# Altium schematic sheet Power Sources and Supply.SchDoc
size Tabloid; DrawnBy: Krutav Shah; SheetNumber: 4; SheetTotal: 6
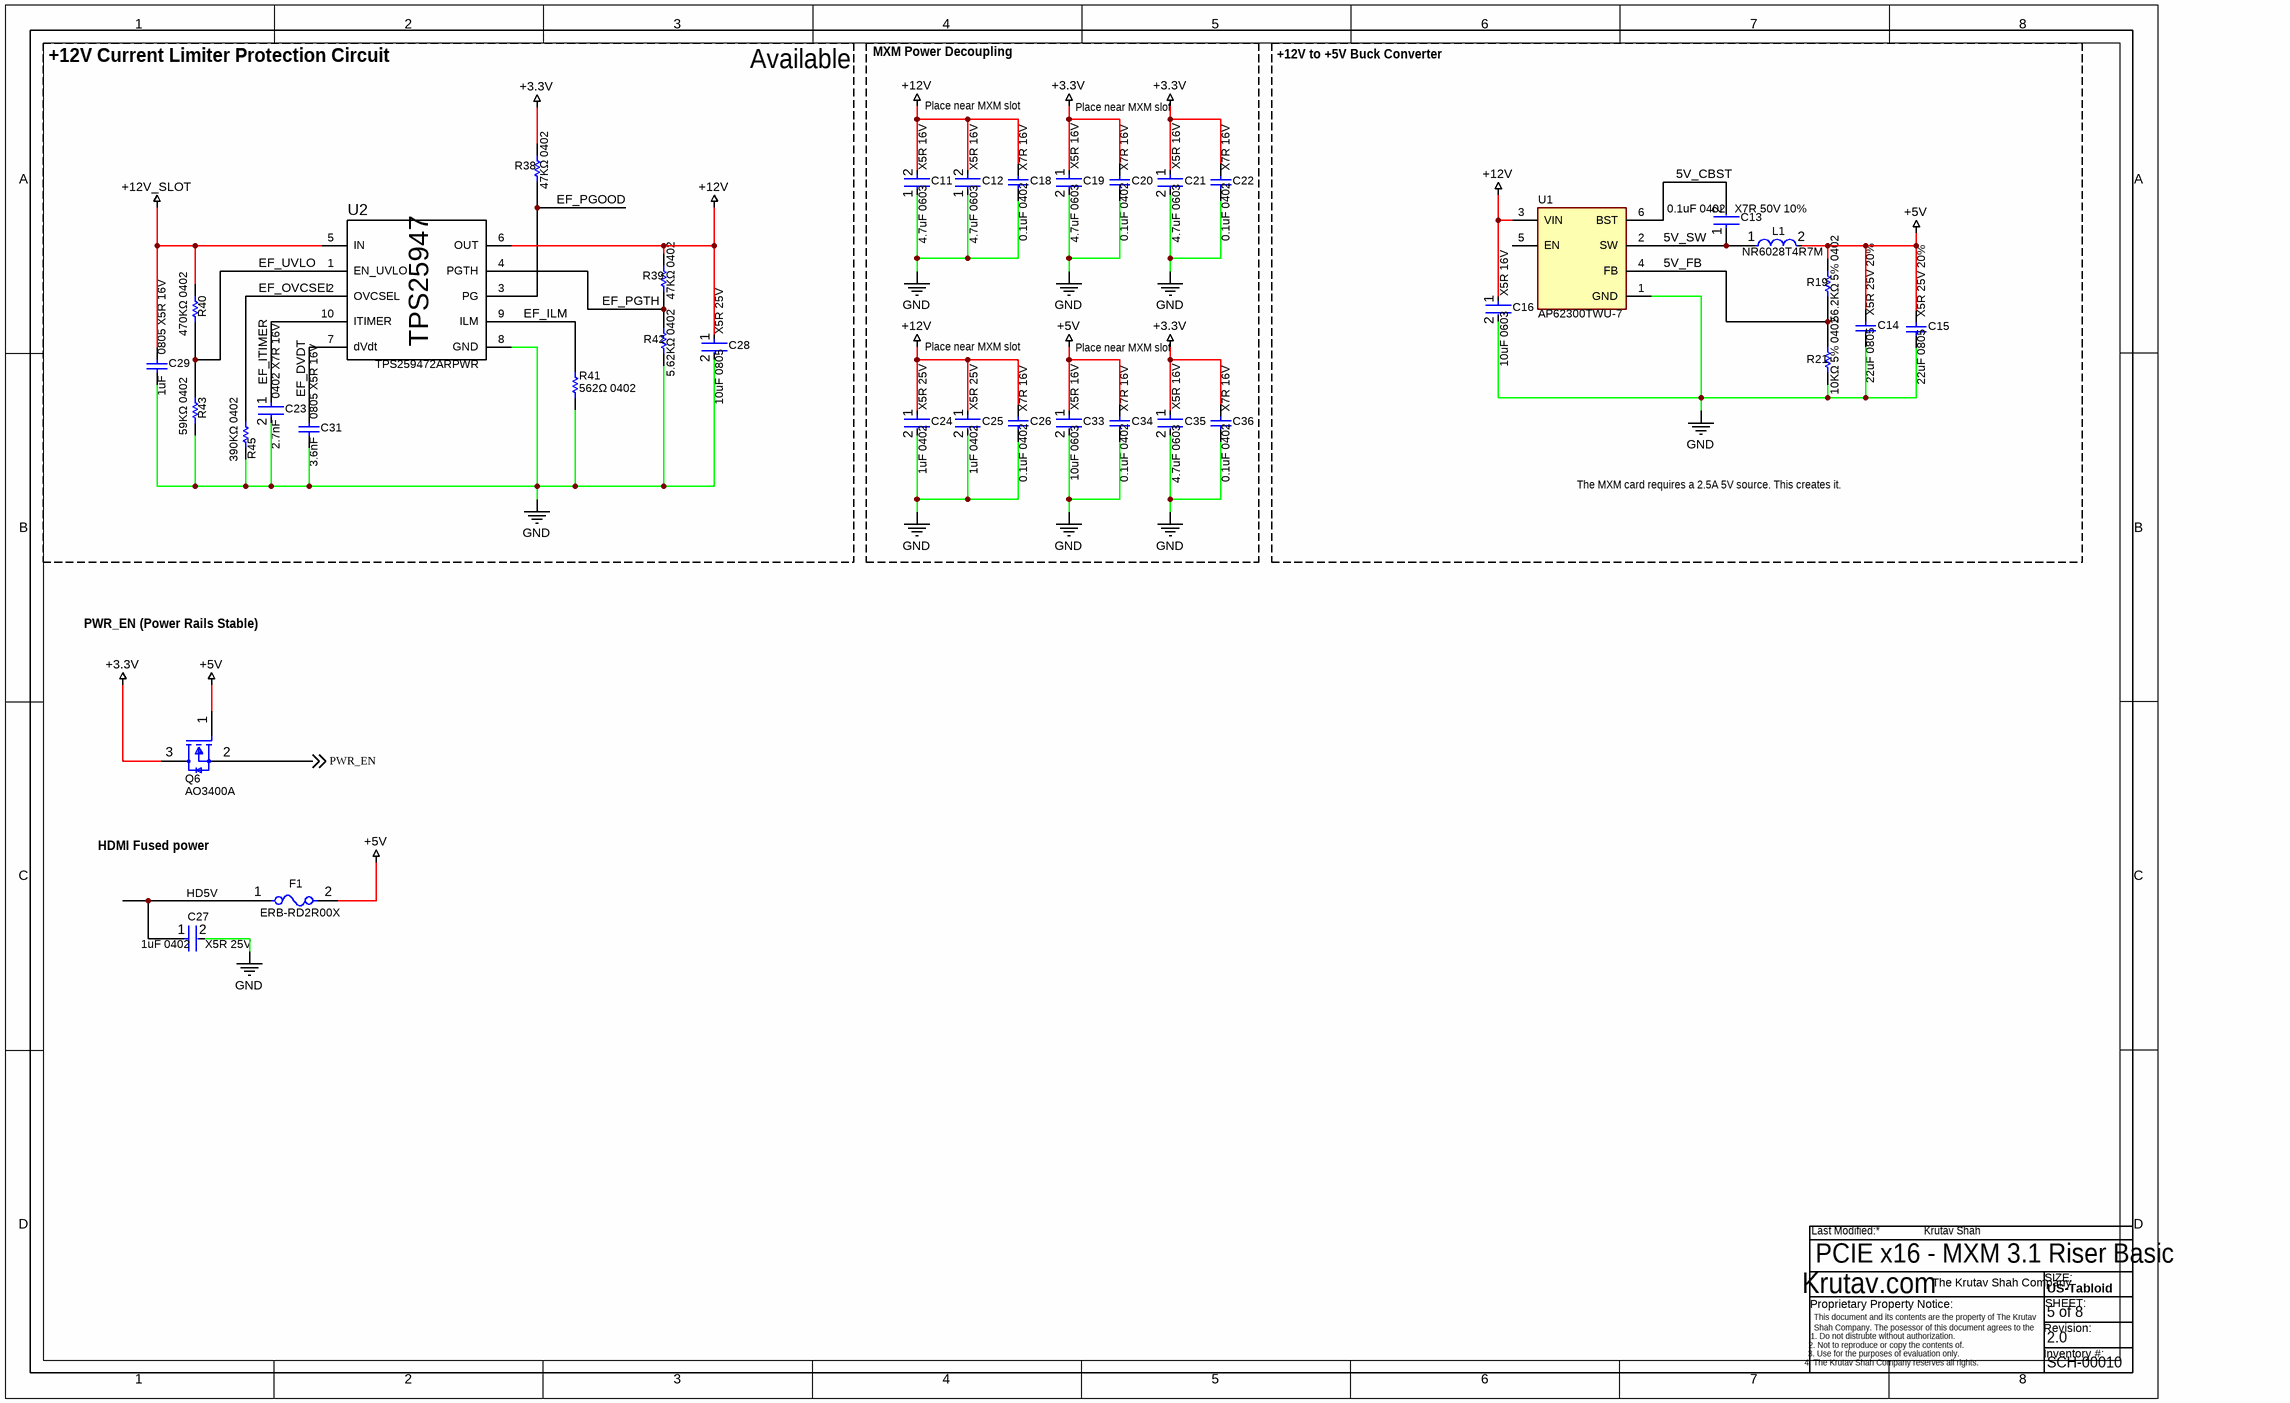
[diagram p0: Power Sources and Supply.SchDoc]

## Parts
C11  4.7uF 0603     X5R 16V  [FP-C1608-080-0_1-IPC_C]
C12  4.7uF 0603     X5R 16V  [FP-C1608-080-0_1-IPC_C]
C13  0.1uF 0402   X7R 50V 10%  [FP-CL779-IPC_C]
C14  22uF 0805    X5R 25V 20%  [CAPC2013X140X45LL15T25]
C15  22uF 0805    X5R 25V 20%  [CAPC2013X140X45LL15T25]
C16  10uF 0603     X5R 16V  [FP-CL21-IPC_A]
C18  0.1uF 0402    X7R 16V  [CAPC1050X55X23ML05T13]
C19  4.7uF 0603     X5R 16V  [FP-CL21-IPC_A]
C20  0.1uF 0402    X7R 16V  [CAPC1050X55X23ML05T13]
C21  4.7uF 0603     X5R 16V  [FP-CL21-IPC_A]
C22  0.1uF 0402    X7R 16V  [CAPC1050X55X23ML05T13]
C23  2.7nF       0402 X7R 16V  [FP-C0402-BB-MFG]
C24  1uF 0402     X5R 25V  [FP-CL542-IPC_C]
C25  1uF 0402     X5R 25V  [FP-CL542-IPC_C]
C26  0.1uF 0402    X7R 16V  [CAPC1050X55X23ML05T13]
C27  1uF 0402     X5R 25V  [FP-CL542-IPC_C]
C28  10uF 0805     X5R 25V  [FP-CL21-IPC_A]
C29  1uF       0805 X5R 16V  [CAPC0603X33X15NL03T05]
C31  3.6nF      0805 X5R 16V  [CAPC0603X33X15NL03T05]
C33  10uF 0603     X5R 16V  [FP-CL21-IPC_A]
C34  0.1uF 0402    X7R 16V  [CAPC1050X55X23ML05T13]
C35  4.7uF 0603     X5R 16V  [FP-CL21-IPC_A]
C36  0.1uF 0402    X7R 16V  [CAPC1050X55X23ML05T13]
F1  ERB-RD2R00X  [FP-ERBRD-MFG]
L1  NR6028T4R7M  [FP-NR6028-MFG]
Q6  AO3400A  [FP-SOT23-MFG]
R19  56.2KΩ 5% 0402  [RESC0201(0603)_L]
R21  10KΩ 5% 0402  [RESC0201(0603)_L]
R38  47KΩ 0402  [RESC0201(0603)_L]
R39  47KΩ 0402  [RESC0201(0603)_L]
R40  470KΩ 0402  [RESC0201(0603)_L]
R41  562Ω 0402  [RESC0201(0603)_L]
R42  5.62KΩ 0402  [RESC0201(0603)_L]
R43  59KΩ 0402  [RESC0201(0603)_L]
R45  390KΩ 0402  [RESC0201(0603)_L]
U1  AP62300TWU-7  [FP-TSOT26-MFG]
U2  TPS259472ARPWR  [RPW0010A-MFG]

## Blocks framed on the sheet
Available: C23 C28 C29 C31 R38-R43 R45 U2
MXM Power Decoupling: C11 C12 C18-C22 C24-C26 C33-C36
+12V to +5V Buck Converter: C13-C16 L1 R19 R21 U1

## Nets
+3.3V: C19.1 C20.2 C21.1 C22.2 C35.1 C36.2 Q6.3(D) R38.1
+5V: C14.2 C15.2 C33.1 C34.2 F1.2 L1.2 Q6.1(G) R19.1
+12V: C11.2 C12.2 C16.1 C18.2 C24.1 C25.1 C26.2 C28.1 R39.1 U1.3(VIN) U2.6(OUT)
+12V_SLOT: C29.1 R40.1 U2.5(IN)
GND: C11.1 C12.1 C14.1 C15.1 C16.2 C18.1 C19.2 C20.1 C21.2 C22.1 C23.2 C24.2 C25.2 C26.1 C27.2 C28.2 C29.2 C31.2 C33.2 C34.1 C35.2 C36.1 R21.1 R41.2 R42.1 R43.1 R45.2 U1.1(GND) U2.8(GND)
5V_CBST: C13.2 U1.6(BST)
5V_FB: R19.2 R21.2 U1.4(FB)
5V_SW: C13.1 L1.1 U1.2(SW)
EF_DVDT: C31.1 U2.7(dVdt)
EF_ILM: R41.1 U2.9(ILM)
EF_ITIMER: C23.1 U2.10(ITIMER)
EF_OVCSEL: R45.1 U2.2(OVCSEL)
EF_PGOOD: R38.2 U2.3(PG)
EF_PGTH: R39.2 R42.2 U2.4(PGTH)
EF_UVLO: R40.2 R43.2 U2.1(EN_UVLO)
PWR_EN: Q6.2(S) ; off-sheet PWR_EN
NetC27_1: C27.1 F1.1

Not connected (* = marked no-connect by the designer): U1 5(EN)

## Notes on the sheet
- +12V Current Limiter Protection Circuit
- Place near MXM slot
- The MXM card requires a 2.5A 5V source. This creates it.
- PWR_EN (Power Rails Stable)
- HDMI Fused power
- (near C27) HD5V
- PCIE x16 - MXM 3.1 Riser Basic
- 5 of 8
- 2.0
- SCH-00010
- Last Modified:
- Krutav.com
- The Krutav Shah Company
- US-Tabloid
- SIZE:
- SHEET:
- This document and its contents are the property of The Krutav Shah Company. The posessor of this document agrees to the following:
- Proprietary Property Notice:
- 1. Do not distrubte without authorization.
- 3. Use for the purposes of evaluation only.
- 2. Not to reproduce or copy the contents of.
- 4. The Krutav Shah Company reserves all rights.
- Revision:
- Inventory #:
- (in symbol TPS259474ARPWR) TPS25947

## Library data of the parts
C11 C12 = CMP-2000-04981-2: Multilayer Ceramic Capacitors 4.7μF ±10% 16V X5R SMD 0603; Tolerance: 10%; Thickness: 0.035inch; Length: 1.6mm; Width: 0.031inch; Height: 0.8mm; Package Quantity: 1; Voltage: 16V; Construction: Flat; Weight: 7.1E-05oz; Depth: 0.8mm; Case Code (Metric): 1608; Series: C; Lead Free: Lead Free; Voltage Rating: 16V; Voltage Rating (DC): 16V; Capacitance: 4.7uF; Termination: SMD/SMT; Dielectric: X5R; REACH SVHC: No SVHC; RoHS Compliant: Yes; Case Code (Imperial): 0603; Case/Package: 0603; Mount: Surface Mount; Dielectric Material: Ceramic; Packaging: Tape and Reel; Min Operating Temperature: -55°C; Max Operating Temperature: 85°C
C13 = CMP-13271-002336-1: Cap Ceramic 100nF 50V X7R ±10% SMD 0402 +125°C Paper T/R
C14 C15 = CMP-2000-06104-1: Multi-layer Ceramic Capacitor, 22 uF, -55 to 85 degC, 2-Pin SMD (0805), RoHS, Tape and Reel; Manufacturer: Samsung Electro-Mechanics; Other Names: 1276-2908-2; Capacitance: 22µF; Featured Product: Multi-LayerCeramicCapacitors; Product Training Modules: HighCapMLCCFamily; Online Catalog: CLSeries,HighCapacitance; Applications: GeneralPurpose; RoHS Information: MLCCRoHS2Compliance; Height - Seated (Max): -; Voltage - Rated: 25V; Lead Style: -; Lead Spacing: -; Datasheet URL: http://datasheet.octopart.com/CL21A226MAQNNNE-Samsung-datasheet-48647558.pdf; Size / Dimension: 0.079"Lx0.049"W(2.00mmx1.25mm); Temperature Coefficient: X5R; Thickness (Max): 0.055"(1.40mm); Family: CeramicCapacitors; Package Description: 2-Pin Surface Mount Device, Body 2.0 x 1.25 mm; Datasheet Version: 07/2015; Packaging: Tape&Reel(TR); Manufacturer URL: http://www.samsungsem.com/global/index.jsp; Ratings: -; Package / Case: 0805(2012Metric); Tolerance: ±20%; Standard Package: 2,000; Mounting Type: SurfaceMount,MLCC; Mounting Technology: SurfaceMount; Category: Capacitors; Package Reference: 0805; Series: CL; Features: -; Operating Temperature: -55°C~85°C
C16 C33 = CMP-13271-002624-1: CL10A106KP8NNNC Series 0603 10uF 10V ±10% Tolerance X5R Multilayer Ceramic Chip Capacitor; Capacitance: 4.7uF; Voltage Rating: 25V; Case Code (Imperial): 0805; Thickness: 0.055inch; Mount: Surface Mount; Case Code (Metric): 2012; Depth: 1.25mm; Lead Free: Lead Free; Case/Package: 0805; Package Quantity: 1; Width: 0.049inch; Radiation Hardening: No; Voltage Rating (DC): 25V; Length: 2mm; Dielectric: X5R; Height: 1.25mm; Packaging: Tape and Reel; Tolerance: 10%; Min Operating Temperature: -55°C; Max Operating Temperature: 85°C
C18 C20 C22 C26 C34 C36 = CMP-2000-05439-1: Chip Capacitor, 100 nF, +/- 10%, 16 V, -55 to 125 degC, 0402 (1005 Metric), RoHS, Tape and Reel; Manufacturer: Samsung Electro-Mechanics; Capacitance: 100000pF; Case Size/Dimension: 0402; Tolerance (%): ±10%; Manufacturer URL: http://www.samsungsem.com/global/index.jsp; Dielectric: X7R; Datasheet URL: https://datasheet.ciiva.com/29198/458718-da-01-en-vs-kondensator-0402-29198423.pdf; Rated Voltage: 16V; Datasheet Version: Nov-10
C19 C21 C35 = CMP-13271-002624-1: CL21 Series 0805 4.7uF 25V ±10% Tolerance X5R Multilayer Ceramic Chip Capacitor; Case Code (Imperial): 0805; Thickness: 0.055inch; Mount: Surface Mount; Case Code (Metric): 2012; Capacitance: 4.7uF; Depth: 1.25mm; Lead Free: Lead Free; Case/Package: 0805; Voltage Rating: 25V; Package Quantity: 1; Width: 0.049inch; Radiation Hardening: No; Voltage Rating (DC): 25V; Length: 2mm; Dielectric: X5R; Height: 1.25mm; Packaging: Tape and Reel; Tolerance: 10%; Min Operating Temperature: -55°C; Max Operating Temperature: 85°C
C23 = CMP-2008-02106-2: CAP CER 2700PF 16V X7R 0402; Manufacturer Part Number: C0402C272K4RACTU; Manufacturer: Kemet; Value: 2,700 pF; Temperature Coefficient: 15%; Material: Ceramic; Tolerance: 0.1; Temperature Characteristic: X7R; ComponentLink2Description: Datasheet; Automotive: No; Temperature Range High: +125°C; Octopart: https://octopart.com/c0402c272k4ractu-kemet-12595530; Device Class L2: Capacitors; Category: Cap; Device Class L1: Passive Components; Temperature Range Low: -55°C; Height: 0.55mm; ComponentLink2URL: https://content.kemet.com/datasheets/KEM_C1002_X7R_SMD.pdf; Temperature: -55°C to +125°C; Package: C0402-BB; Device Class L3: Ceramic Capacitors; Ipc Land Pattern Name: CAPC10050X50; Digikey Description: CAP CER 2700PF 16V X7R 0402; Lead Free: Yes; Voltage Rating: 16 V; RoHS: TRUE; Capacitance: 2,700 pF; Mouser Description: Cap Ceramic 0.0027uF 16V X7R 10% SMD 0402 125°C Paper T/R
C24 C25 C27 = CMP-13271-001051-1: Cap Ceramic 1uF 25V X5R ±10% SMD 0402 +85°C Paper T/R; Radiation Hardening: No; Lead Free: Lead Free; Capacitance: 1uF; Package Quantity: 10000; Max Operating Temperature: 85°C; Voltage Rating: 25V; Case/Package: 0402; Min Operating Temperature: -55°C; Packaging: Tape and Reel; Tolerance: 10%; Height: 0.5mm; Thickness: 0.022inch; Case Code (Metric): 1005; Width: 0.02inch; Case Code (Imperial): 0402; Dielectric: X5R; Length: 1mm; Mount: Surface Mount; Material: Ceramic; Depth: 0.5mm
C28 = CMP-13271-002975-1: CL21 Series 0805 10uF 25V ±10% Tolerance X5R Multilayer Ceramic Chip Capacitor; Case Code (Imperial): 0805; Length: 2mm; Case/Package: 0805; Packaging: Tape and Reel; Width: 0.049inch; Tolerance: 10%; Mount: Surface Mount; Min Operating Temperature: -55°C; Thickness: 0.057inch; Height: 1.25mm; Dielectric: X5R; Package Quantity: 1; Depth: 1.25mm; Capacitance: 10uF; Voltage Rating: 25V; Case Code (Metric): 2012; Max Operating Temperature: 85°C; Radiation Hardening: No
C29 C31 = CMP-2010-00679-1: Manufacturer: Samsung; Part Number: CL03A224MQ3NNNC
F1 = CMP-05590-000001-1: FUSE BOARD MOUNT 2A 32VDC 0402; Manufacturer: Panasonic Electronic Components; Resistance: 53mΩ; Value: 53mΩ; Voltage Rating: 32V; Fuse Interrupt Dc Current: 35A; Fuse Blow Speed: Fast; Digikey Description: FUSE BOARD MOUNT 2A 32VDC 0402; ComponentLink2Description: Datasheet; Fuse Current: 2A; Device Class L2: Fuses; Category: Fuse; Octopart: https://octopart.com/erb-rd2r00x-panasonic-21220532; RoHS: TRUE; Device Class L1: Circuit Protection; Temperature Range High: +125°C; Height: 0.49mm; Device Class L3: unset; Max Fuse Dc Voltage: 32V; Automotive: No; Manufacturer Part Number: ERB-RD2R00X; Lead Free: Yes; Temperature Range Low: -40°C; Mouser Description: Surface Mount Fuses 2A 0402 micro chip; ComponentLink2URL: https://industrial.panasonic.com/cdbs/www-data/pdf/AFA0000/AFA0000C7.pdf; Temperature: -40°C to +125°C; Package: ERBRD
L1 = CMP-14484-000037-2: SMD Power Inductors 4.7uH ±20% 2.7A 40.3mΩ; Max DC Current: 3A; Shielding: Shielded; Core Material: Ferrite; Test Frequency: 100kHz; Self Resonant Frequency: 39MHz; DC Resistance (DCR): 40.3mR; Package Quantity: 2000; Mount: Surface Mount; Max Operating Temperature: 120°C; Min Operating Temperature: -25°C; Series: NR; Case/Package: 2424; Depth: 6.2mm; Inductance Tolerance: 20%; Halogen Free: Halogen Free; Inductance: 4.7uH; Tolerance: 20%; RoHS Compliant: Yes; Width: 0.236inch; Length: 0.236inch; Lead Free: Lead Free; Radiation Hardening: No; Packaging: Tape and Reel; Number of Pins: 2; Saturation Current: 2.7A; Current Rating: 3A; Height - Seated (Max): 0.11inch; RMS Current (Irms): 3A; Termination: SMD/SMT; Height: 2.8mm; Resistor Type: Wirewound
Q6 = CMP-83955-000006-1: MOSFET N-CH 30V 5.7A SOT23; Input Capacitance: 630pF; Number of Elements: 1; Rds On Max: 26.5mR; Max Power Dissipation: 1.4W; Gate to Source Voltage (Vgs): 12V; Min Operating Temperature: -55°C; Lead Free: Lead Free; Number of Pins: 3; Drain to Source Voltage (Vdss): 30V; Case/Package: SOT-23; Mount: Surface Mount; Continuous Drain Current (ID): 5.7A; Radiation Hardening: No; Packaging: Tape and Reel; Max Operating Temperature: 150°C; Power Dissipation: 1.4W
R19 R21 R38 R39 R41-R43 R45 = CMP-1010-00755-1: 1M 0.05W 1% 0201 (0603 Metric)  SMD; Case-Metric: 0603; Value: 1000000.00 Ohm; Case-EIA: 0201; Technology: SMT; Tolerance: 1 %; Power: 0.05 W
R40 = CMP-1010-00755-1: 0402WGF4703TCE; Tolerance: 1 %; Case-Metric: 0603; Value: 1000000.00 Ohm; Case-EIA: 0201; Power: 0.05 W; Technology: SMT
U1 = CMP-12757-000010-1: IC REG BUCK ADJUSTABLE 2A TSOT26; Manufacturer: Diodes Inc.; Manufacturer Part Number: AP63200WU-7; Switching Frequency: 500kHz; Max Supply Voltage: 32V; Number Of Outputs: 1; Nominal Supply Current: 22uA; Min Supply Voltage: 3.8V; Output Type: AdjustableProgrammable; Max Junction Temp: +160°C; Standoff Height: 0.01mm; Octopart: https://octopart.com/ap63200wu-7-diodes+inc.-98099548; Height: 1mm; Temperature Range Low: -40°C; Output Current: 2A; ComponentLink2URL: https://www.diodes.com/assets/Datasheets/AP63200-AP63201-AP63203-AP63205.pdf; Switching Topology: Buck; Automotive: No; Device Class L1: Integrated Circuits (ICs); Ipc Land Pattern Name: SOT95P280X100-6; Package: TSOT26; Temperature Range High: +85°C; RoHS: TRUE; Ambient Temperature Range High: +85°C; Device Class L3: Voltage Regulators - Switching; Temperature: -40°C to +85°C; Device Class L2: Power Management ICs; Footprint Url: https://www.diodes.com/assets/Package-Files/TSOT26.pdf; Mouser Description: AP63200 Series 1.2 V 2 A Adjustable Synchronous Buck Converter - TSOT-26; Category: IC; ComponentLink2Description: Datasheet; Digikey Description: IC REG BUCK ADJUSTABLE 2A TSOT26; Lead Free: Yes; Ambient Temperature Range Low: -40°C
U2 = TPS259474ARPWR: No Description Available; Mfr_Name: Texas Instruments; Type: DEV; RefDes: RefDes; Copyright: Copyright (C) 2021 Ultra Librarian. All rights reserved.; Manufacturer_Part_Number: TPS259474ARPWR; Digi-Key_Part_Number_1: 296-TPS259474ARPWRCT-ND; Digi-Key_Part_Number_2: 296-TPS259474ARPWRDKR-ND; Digi-Key_Part_Number_3: 296-TPS259474ARPWRTR-ND; Supplier 1: Digi-Key; Supplier Part Number 1: 296-TPS259472ARPWRDKR-ND